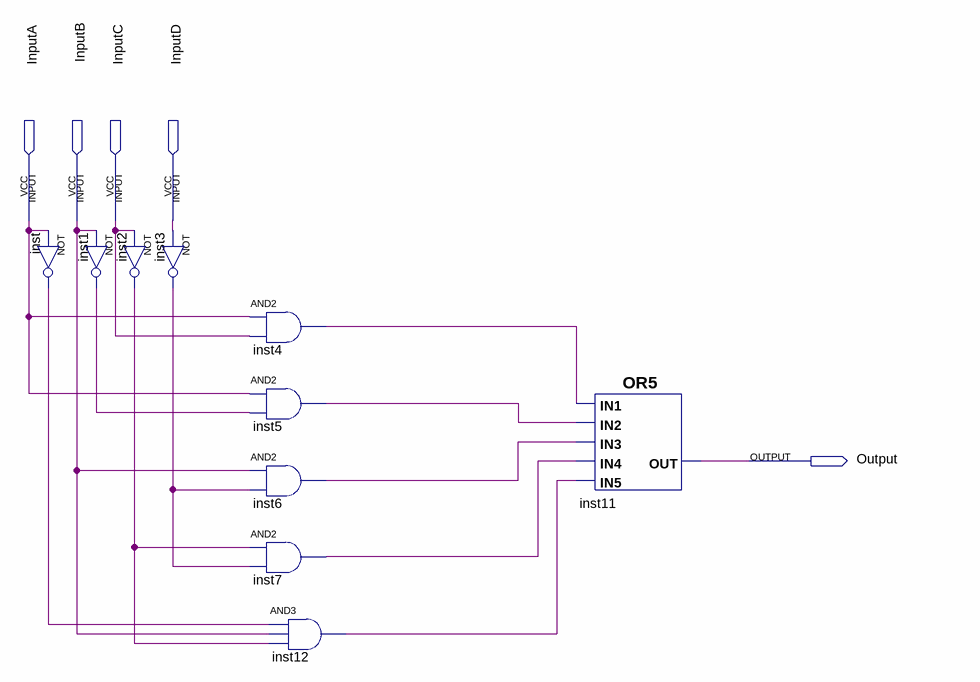
[diagram p0: schematic sheet]
// Quartus schematic SegF.bdf as structural Verilog: 10 symbols, 5 pins
module SegF (
  input  InputA,
  input  InputB,
  input  InputC,
  input  InputD,
  output Output
);

  wire inst1_out, inst2_out, inst3_out, inst4_out, inst5_out, inst6_out, inst7_out, inst12_out, inst_out;

  not inst (inst_out, InputA);
  not inst2 (inst2_out, InputC);
  not inst1 (inst1_out, InputB);
  not inst3 (inst3_out, InputD);
  and inst4 (inst4_out, InputA, InputC);
  and inst5 (inst5_out, InputA, inst1_out);
  and inst6 (inst6_out, InputB, inst3_out);
  and inst7 (inst7_out, inst2_out, inst3_out);
  and inst12 (inst12_out, inst_out, InputB, inst2_out);
  or inst11 (Output, inst4_out, inst5_out, inst6_out, inst7_out, inst12_out);
endmodule
